# Altium project Skinhear_rev1.1.PrjPcb
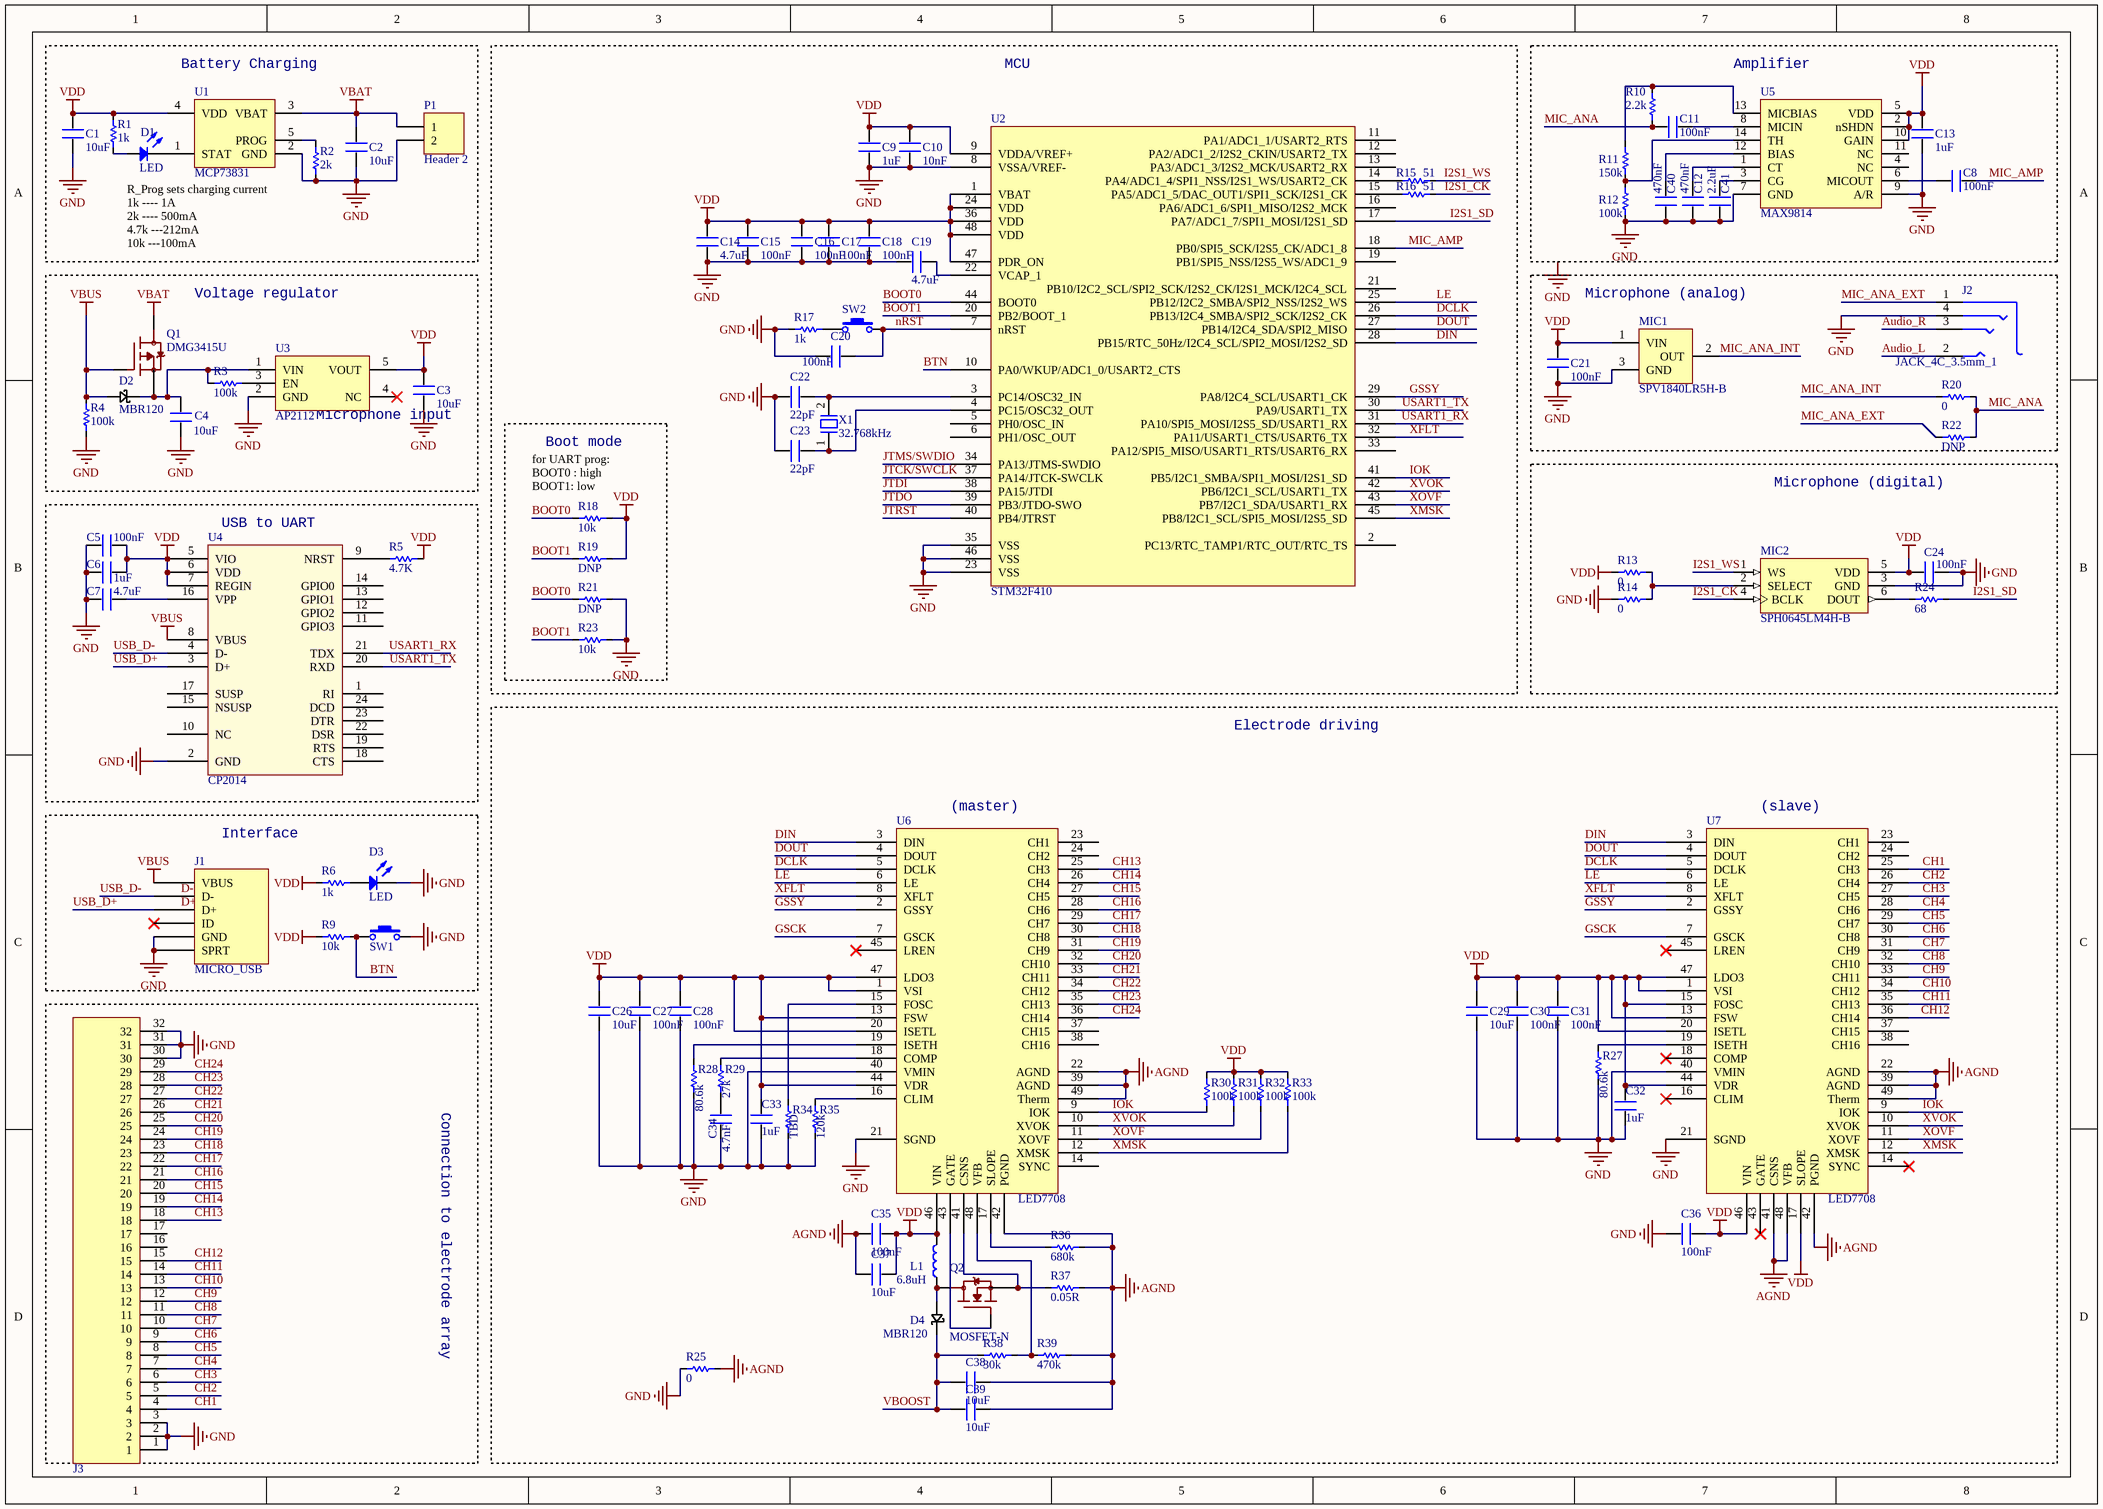
[diagram p0: Skinhear_rev1.1.SchDoc]
1 sheet, 99 parts. Net scope: global (net labels, ports and power ports of the same name join across sheets).
Board file: Skinhear_rev1.1.PcbDoc

## Sheet Skinhear_rev1.1.SchDoc
size A3

### Parts
C1  value 10uF  [C0402]  (hidden comment: C)
C2  value 10uF  [C0402]  (hidden comment: C)
C3  value 10uF  [C0402]  (hidden comment: C)
C4  value 10uF  [C0402]  (hidden comment: C)
C5  value 100nF  [C0402]  (hidden comment: C)
C6  value 1uF  [C0402]  (hidden comment: C)
C7  value 4.7uF  [C0402]  (hidden comment: C)
C8  value 100nF  [C0402]  (hidden comment: C)
C9  value 1uF  [C0402]  (hidden comment: C)
C10  value 10nF  [C0402]  (hidden comment: C)
C11  value 100nF  [C0402]  (hidden comment: C)
C12  value 470nF  [C0402]  (hidden comment: C)
C13  value 1uF  [C0402]  (hidden comment: C)
C14  value 4.7uF  [C0402]  (hidden comment: C)
C15  value 100nF  [C0402]  (hidden comment: C)
C16  value 100nF  [C0402]  (hidden comment: C)
C17  value 100nF  [C0402]  (hidden comment: C)
C18  value 100nF  [C0402]  (hidden comment: C)
C19  value 4.7uF  [C0402]  (hidden comment: C)
C20  value 100nF  [C0402]  (hidden comment: C)
C21  value 100nF  [C0402]  (hidden comment: C)
C22  value 22pF  [C0402]  (hidden comment: C)
C23  value 22pF  [C0402]  (hidden comment: C)
C24  value 100nF  [C0402]  (hidden comment: C)
C26  value 10uF  [C0402]  (hidden comment: C)
C27  value 100nF  [C0402]  (hidden comment: C)
C28  value 100nF  [C0402]  (hidden comment: C)
C29  value 10uF  [C0402]  (hidden comment: C)
C30  value 100nF  [C0402]  (hidden comment: C)
C31  value 100nF  [C0402]  (hidden comment: C)
C32  value 1uF  [C0402]  (hidden comment: C)
C33  value 1uF  [C0402]  (hidden comment: C)
C34  value 4.7nF  [C0402]  (hidden comment: C)
C35  value 100nF  [C0402]  (hidden comment: C)
C36  value 100nF  [C0402]  (hidden comment: C)
C37  value 10uF  [C0402]  (hidden comment: C)
C38  value 10uF  [C0402]  (hidden comment: C)
C39  value 10uF  [C0402]  (hidden comment: C)
C40  value 470nF  [C0402]  (hidden comment: C)
C41  value 2.2uF  [C0402]  (hidden comment: C)
D1  LED  [0603 LED]
D2  MBR120  [SOD123FL]
D3  LED  [0603 LED]
D4  MBR120  [SOD123FL]
J1  MICRO_USB  [USB-B-MICRO-SMD_V03]
J2  JACK_4C_3.5mm_1  [PJ-313E-8A]
J3  CONN_32P  [XF2M-3215-1A]  (value not drawn)
L1  6.8uH  [CKCS252010]
MIC1  SPV1840LR5H-B  [SPV1840LR5H-B]
MIC2  SPH0645LM4H-B  [MIC_SPH0645LM4H-B]
P1  Header 2  [HDR1X2]
Q1  DMG3415U  [DMG3415U SOT23-3]
Q2  MOSFET-N  [SOT23_AO3400]
R1  value 1k  [R0402]  (hidden comment: R)
R2  value 2k  [R0402]  (hidden comment: R)
R3  value 100k  [R0402]  (hidden comment: R)
R4  value 100k  [R0402]  (hidden comment: R)
R5  value 4.7K  [R0402]  (hidden comment: R)
R6  value 1k  [R0402]  (hidden comment: R)
R9  value 10k  [R0402]  (hidden comment: R)
R10  value 2.2k  [R0402]  (hidden comment: R)
R11  value 150k  [R0402]  (hidden comment: R)
R12  value 100k  [R0402]  (hidden comment: R)
R13  value 0  [R0402]  (hidden comment: R)
R14  value 0  [R0402]  (hidden comment: R)
R15  value 51  [R0402]  (hidden comment: R)
R16  value 51  [R0402]  (hidden comment: R)
R17  value 1k  [R0402]  (hidden comment: R)
R18  value 10k  [R0402]  (hidden comment: R)
R19  value DNP  [R0402]  (hidden comment: R)
R20  value 0  [R0402]  (hidden comment: R)
R21  value DNP  [R0402]  (hidden comment: R)
R22  value DNP  [R0402]  (hidden comment: R)
R23  value 10k  [R0402]  (hidden comment: R)
R24  value 68  [R0402]  (hidden comment: R)
R25  value 0  [R0402]  (hidden comment: R)
R27  value 80.6k  [R0402]  (hidden comment: R)
R28  value 80.6k  [R0402]  (hidden comment: R)
R29  value 27k  [R0402]  (hidden comment: R)
R30  value 100k  [R0402]  (hidden comment: R)
R31  value 100k  [R0402]  (hidden comment: R)
R32  value 100k  [R0402]  (hidden comment: R)
R33  value 100k  [R0402]  (hidden comment: R)
R34  value TBD  [R0402]  (hidden comment: R)
R35  value 120k  [R0402]  (hidden comment: R)
R36  value 680k  [R0402]  (hidden comment: R)
R37  value 0.05R  [R1206]  (hidden comment: R)
R38  value 30k  [R0402]  (hidden comment: R)
R39  value 470k  [R0402]  (hidden comment: R)
SW1  TACT_SWITCH  [KMR2_tact_switch]  (value not drawn)
SW2  TACT_SWITCH  [KMR2_tact_switch]  (value not drawn)
U1  MCP73831  [MCP73831 SOT23-5]
U2  STM32F410  [STM32F4xx, LQFP48]
U3  AP2112  [AP2112 SOT23-5]
U4  CP2014  [cp2104 QFN24]
U5  MAX9814  [MAX9814, SON-14]
U6  LED7708  [LED7708 QFN48]
U7  LED7708  [LED7708 QFN48]
X1  32.768kHz  [CRYSTAL_2P_3.2X1.5]

### Blocks framed on the sheet
Battery Charging: C1 C2 D1 P1 R1 R2 U1
MCU: C9 C10 C14-C20 C22 C23 R15-R17 SW2 U2 X1
Amplifier: C8 C11-C13 C40 C41 R10-R12 U5
Microphone (analog): C21 J2 MIC1 R20 R22
Boot mode: R18 R19 R21 R23
Microphone (digital): C24 MIC2 R13 R14 R24
USB to UART: C5-C7 R5 U4
Interface: D3 J1 R6 R9 SW1
Connection to electrode array: J3

### Nets
AGND: C35.1 C37.1 C38.1 C39.1 R25.2 R36.1 R37.1 R39.1 U6.22(AGND) U6.39(AGND) U6.42(PGND) U6.49(Therm) U7.22(AGND) U7.39(AGND) U7.41(CSNS) U7.42(PGND) U7.48(VFB) U7.49(Therm)
GND: C1.2 C2.2 C3.2 C4.2 C5.2 C6.2 C7.2 C9.1 C10.1 C12.2 C13.2 C14.1 C15.1 C16.1 C17.1 C18.1 C19.1 C20.1 C21.1 C22.1 C23.1 C24.2 C26.2 C27.2 C28.2 C29.2 C30.2 C31.2 C32.2 C33.2 C34.2 C36.1 C40.2 C41.2 D3.2(K) J1.5(GND) J1.SPRT J2.4 J3.1 J3.2 J3.3 J3.30 J3.31 J3.32 J3.33 J3.34 MIC1.3(GND) MIC2.3(GND) P1.2 R2.2 R4.2 R12.2 R14.1 R17.1 R21.1 R23.1 R25.1 R27.1 R28.1 R34.1 R35.1 SW1.2 U1.2(GND) U2.8(VSSA/VREF-) U2.23(VSS) U2.35(VSS) U2.46(VSS) U3.2(GND) U4.2(GND) U4.25(gnd) U5.7(GND) U5.9(A/R) U5.15 U6.21(SGND) U6.40(VMIN) U7.21(SGND) U7.40(VMIN)
VBAT: C2.1 P1.1 Q1.3(D) U1.3(VBAT)
VBUS: D2.2(ANO) J1.1(VBUS) Q1.1(G) R4.1 U4.8(VBUS)
VDD: C1.1 C3.1 C5.1 C6.1 C9.2 C10.2 C13.1 C14.2 C15.2 C16.2 C17.2 C18.2 C21.2 C24.1 C26.1 C27.1 C28.1 C29.1 C30.1 C31.1 C32.1 C33.1 C35.2 C36.2 C37.2 L1.2 MIC1.1(VIN) MIC2.5(VDD) R1.2 R5.1 R6.2 R9.2 R13.1 R18.1 R19.1 R30.1 R31.1 R32.1 R33.1 U1.4(VDD) U2.1(VBAT) U2.9(VDDA/VREF+) U2.24(VDD) U2.36(VDD) U2.47(PDR_ON) U2.48(VDD) U3.5(VOUT) U4.5(VIO) U4.6(VDD) U4.7(REGIN) U5.2(nSHDN) U5.5(VDD) U5.10(GAIN) U6.1(VSI) U6.13(FSW) U6.20(ISETL) U6.44(VDR) U6.46(VIN) U6.47(LDO3) U7.1(VSI) U7.13(FSW) U7.15(FOSC) U7.17(SLOPE) U7.20(ISETL) U7.44(VDR) U7.46(VIN) U7.47(LDO3)
Audio_L: J2.2
Audio_R: J2.3
BOOT0: R18.2 R21.2 U2.44(BOOT0)
BOOT1: R19.2 R23.2 U2.20(PB2/BOOT_1)
BTN: R9.1 SW1.1 U2.10(PA0/WKUP/ADC1_0/USART2_CTS)
CH1: J3.4 U7.25(CH3)
CH2: J3.5 U7.26(CH4)
CH3: J3.6 U7.27(CH5)
CH4: J3.7 U7.28(CH6)
CH5: J3.8 U7.29(CH7)
CH6: J3.9 U7.30(CH8)
CH7: J3.10 U7.31(CH9)
CH8: J3.11 U7.32(CH10)
CH9: J3.12 U7.33(CH11)
CH10: J3.13 U7.34(CH12)
CH11: J3.14 U7.35(CH13)
CH12: J3.15 U7.36(CH14)
CH13: J3.18 U6.25(CH3)
CH14: J3.19 U6.26(CH4)
CH15: J3.20 U6.27(CH5)
CH16: J3.21 U6.28(CH6)
CH17: J3.22 U6.29(CH7)
CH18: J3.23 U6.30(CH8)
CH19: J3.24 U6.31(CH9)
CH20: J3.25 U6.32(CH10)
CH21: J3.26 U6.33(CH11)
CH22: J3.27 U6.34(CH12)
CH23: J3.28 U6.35(CH13)
CH24: J3.29 U6.36(CH14)
DCLK: U2.26(PB13/I2C4_SMBA/SPI2_SCK/I2S2_CK) U6.5(DCLK) U7.5(DCLK)
DIN: U2.28(PB15/RTC_50Hz/I2C4_SCL/SPI2_MOSI/I2S2_SD) U6.3(DIN) U7.3(DIN)
DOUT: U2.27(PB14/I2C4_SDA/SPI2_MISO) U6.4(DOUT) U7.4(DOUT)
GSCK: U6.7(GSCK) U7.7(GSCK)
GSSY: U2.29(PA8/I2C4_SCL/USART1_CK) U6.2(GSSY) U7.2(GSSY)
I2S1_CK: MIC2.4(BCLK) R16.2
I2S1_SD: R24.2 U2.17(PA7/ADC1_7/SPI1_MOSI/I2S1_SD)
I2S1_WS: MIC2.1(WS) R15.2
IOK: R30.2 U2.41(PB5/I2C1_SMBA/SPI1_MOSI/I2S1_SD) U6.9(IOK) U7.9(IOK)
JTCK/SWCLK: U2.37(PA14/JTCK-SWCLK)
JTDI: U2.38(PA15/JTDI)
JTDO: U2.39(PB3/JTDO-SWO)
JTMS/SWDIO: U2.34(PA13/JTMS-SWDIO)
JTRST: U2.40(PB4/JTRST)
LE: U2.25(PB12/I2C2_SMBA/SPI2_NSS/I2S2_WS) U6.6(LE) U7.6(LE)
MIC_AMP: C8.1 U2.18(PB0/SPI5_SCK/I2S5_CK/ADC1_8)
MIC_ANA: C11.1 R10.2 R20.2 R22.2
MIC_ANA_EXT: J2.1 R22.1
MIC_ANA_INT: MIC1.2(OUT) R20.1
nRST: C20.2 SW2.2 U2.7(nRST)
USART1_RX: U2.31(PA10/SPI5_MOSI/I2S5_SD/USART1_RX) U4.21(TDX)
USART1_TX: U2.30(PA9/USART1_TX) U4.20(RXD)
USB_D+: J1.3(D+) U4.3(D+)
USB_D-: J1.2(D-) U4.4(D-)
VBOOST: C38.2 C39.2 D4.1(CAT) R38.2
XFLT: U2.32(PA11/USART1_CTS/USART6_TX) U6.8(XFLT) U7.8(XFLT)
XMSK: R33.2 U2.45(PB8/I2C1_SCL/SPI5_MOSI/I2S5_SD) U6.12(XMSK) U7.12(XMSK)
XOVF: R32.2 U2.43(PB7/I2C1_SDA/USART1_RX) U6.11(XOVF) U7.11(XOVF)
XVOK: R31.2 U2.42(PB6/I2C1_SCL/USART1_TX) U6.10(XVOK) U7.10(XVOK)
NetC4_1: C4.1 D2.1(CAT) Q1.2(S) R3.2 U3.1(VIN)
NetC7_1: C7.1 U4.16(VPP)
NetC8_2: C8.2 U5.6(MICOUT)
NetC11_2: C11.2 U5.8(MICIN)
NetC12_1: C12.1 U5.1(CT)
NetC19_2: C19.2 U2.22(VCAP_1)
NetC22_2: C22.2 U2.3(PC14/OSC32_IN) X1.2
NetC23_2: C23.2 U2.4(PC15/OSC32_OUT) X1.1
NetC34_1: C34.1 R29.1
NetC40_1: C40.1 U5.12(BIAS)
NetC41_1: C41.1 U5.3(CG)
NetD1_1: D1.1(A) R1.1
NetD1_2: D1.2(K) U1.1(STAT)
NetD3_1: D3.1(A) R6.1
NetD4_2: D4.2(ANO) L1.1 Q2.3(D)
NetMIC2_2: MIC2.2(SELECT) R13.2 R14.2
NetMIC2_6: MIC2.6(DOUT) R24.1
NetQ2_1: Q2.1(G) U6.43(GATE)
NetQ2_2: Q2.2(S) R37.2 U6.41(CSNS)
NetR2_1: R2.1 U1.5(PROG)
NetR3_1: R3.1 U3.3(EN)
NetR5_2: R5.2 U4.9(NRST)
NetR10_1: R10.1 R11.1 U5.13(MICBIAS)
NetR11_2: R11.2 R12.1 U5.14(TH)
NetR15_1: R15.1 U2.14(PA4/ADC1_4/SPI1_NSS/I2S1_WS/USART2_CK)
NetR16_1: R16.1 U2.15(PA5/ADC1_5/DAC_OUT1/SPI1_SCK/I2S1_CK)
NetR17_2: R17.2 SW2.1
NetR27_2: R27.2 U7.19(ISETH)
NetR28_2: R28.2 U6.19(ISETH)
NetR29_2: R29.2 U6.18(COMP)
NetR34_2: R34.2 U6.15(FOSC)
NetR35_2: R35.2 U6.16(CLIM)
NetR36_2: R36.2 U6.17(SLOPE)
NetR38_1: R38.1 R39.2 U6.48(VFB)

Not connected (* = marked no-connect by the designer): J1 4(ID)*; J3 16 17; U2 2(PC13/RTC_TAMP1/RTC_OUT/RTC_TS) 5(PH0/OSC_IN) 6(PH1/OSC_OUT) 11(PA1/ADC1_1/USART2_RTS) 12(PA2/ADC1_2/I2S2_CKIN/USART2_TX) 13(PA3/ADC1_3/I2S2_MCK/USART2_RX) 16(PA6/ADC1_6/SPI1_MISO/I2S2_MCK) 19(PB1/SPI5_NSS/I2S5_WS/ADC1_9) 21(PB10/I2C2_SCL/SPI2_SCK/I2S2_CK/I2S1_MCK/I2C4_SCL) 33(PA12/SPI5_MISO/USART1_RTS/USART6_RX); U3 4(NC)*; U4 1(RI) 10(NC) 11(GPIO3) 12(GPIO2) 13(GPIO1) 14(GPIO0) 15(NSUSP) 17(SUSP) 18(CTS) 19(RTS) 22(DSR) 23(DTR) 24(DCD); U5 4(NC) 11(NC); U6 14(SYNC) 23(CH1) 24(CH2) 37(CH15) 38(CH16) 45(LREN)*; U7 14(SYNC)* 16(CLIM)* 18(COMP)* 23(CH1) 24(CH2) 37(CH15) 38(CH16) 43(GATE)* 45(LREN)*

### Notes on the sheet
- R_Prog sets charging current
  1k ---- 1A
  2k ---- 500mA
  4.7k ---212mA
  10k ---100mA
- Voltage regulator
- Microphone input
- (near R18) for UART prog:
  BOOT0 : high
  BOOT1: low
- Electrode driving
- (near U6) (master)
- (near U7) (slave)
- Labels drawn without touching a wire or pin: D+, D-, GND

### Library data of the parts
C1-C24 C26-C41 = C: Ceramic Capacitor SMD
D4 = MBR120: Schottky Power Rectifier 20V 1A
J1 = MICRO_USB: Micro USB type B socket
J2 = JACK_4C_3.5mm_1: 3.5mm SMT Audio Jack, 4 contacts
L1 = L: Inductor
MIC1 = SPV1840LR5H-B: Analog MEMS Microphone
MIC2 = SPH0645LM4H-B: Mic Mems Digital I2s Omni -26db; MF: Knowles; Availability: Unavailable; Package: SIP-7 Bourns; Price: None; SnapEDA_Link: https://www.snapeda.com/parts/SPH0645LM4H-B/Knowles/view-part/?ref=snap; MP: SPH0645LM4H-B; Value: *
P1 = Header 2: Header, 2-Pin; LatestRevisionDate: 17-Jul-2002; LatestRevisionNote: Re-released for DXP Platform.; Publisher: Altium Limited
Q1 = MOSFET-P: P-Channel Mosfet
Q2 = MOSFET-N: N-Channel Mosfet
R1-R6 R9-R25 R27-R39 = R: Resistor SMD
SW1 SW2 = TACT_SWITCH: Pushbuttons
U1 = MCP73831: Miniature Single-Cell, Fully Integrated Li-Ion,  Li-Polymer Charge Management Controller
U2 = STM32F410: Arm®-Cortex®-M4 32b MCU+FPU, 125 DMIPS, 128KB Flash,   32KB RAM, 9 TIMs, 1 ADC, 1 DAC, 1 LPTIM, 9 comm. interfaces
U3 = AP2112: 600mA CMOS LDO REGULATOR WITH ENABLE
U4 = CP2014: SINGLE-CHIP USB-TO-UART BRIDGE
U5 = MAX9814: Microphone Amplifier with AGC and  Low-Noise Microphone Bias
U6 U7 = LED7708: 16 channels x 85 mA LED driver with boost controller and 4-wire  serial interface
X1 = Crystal_2: Crystal Oscillator